# EAGLE schematic VERSAO-01 (EAGLE 5.06)
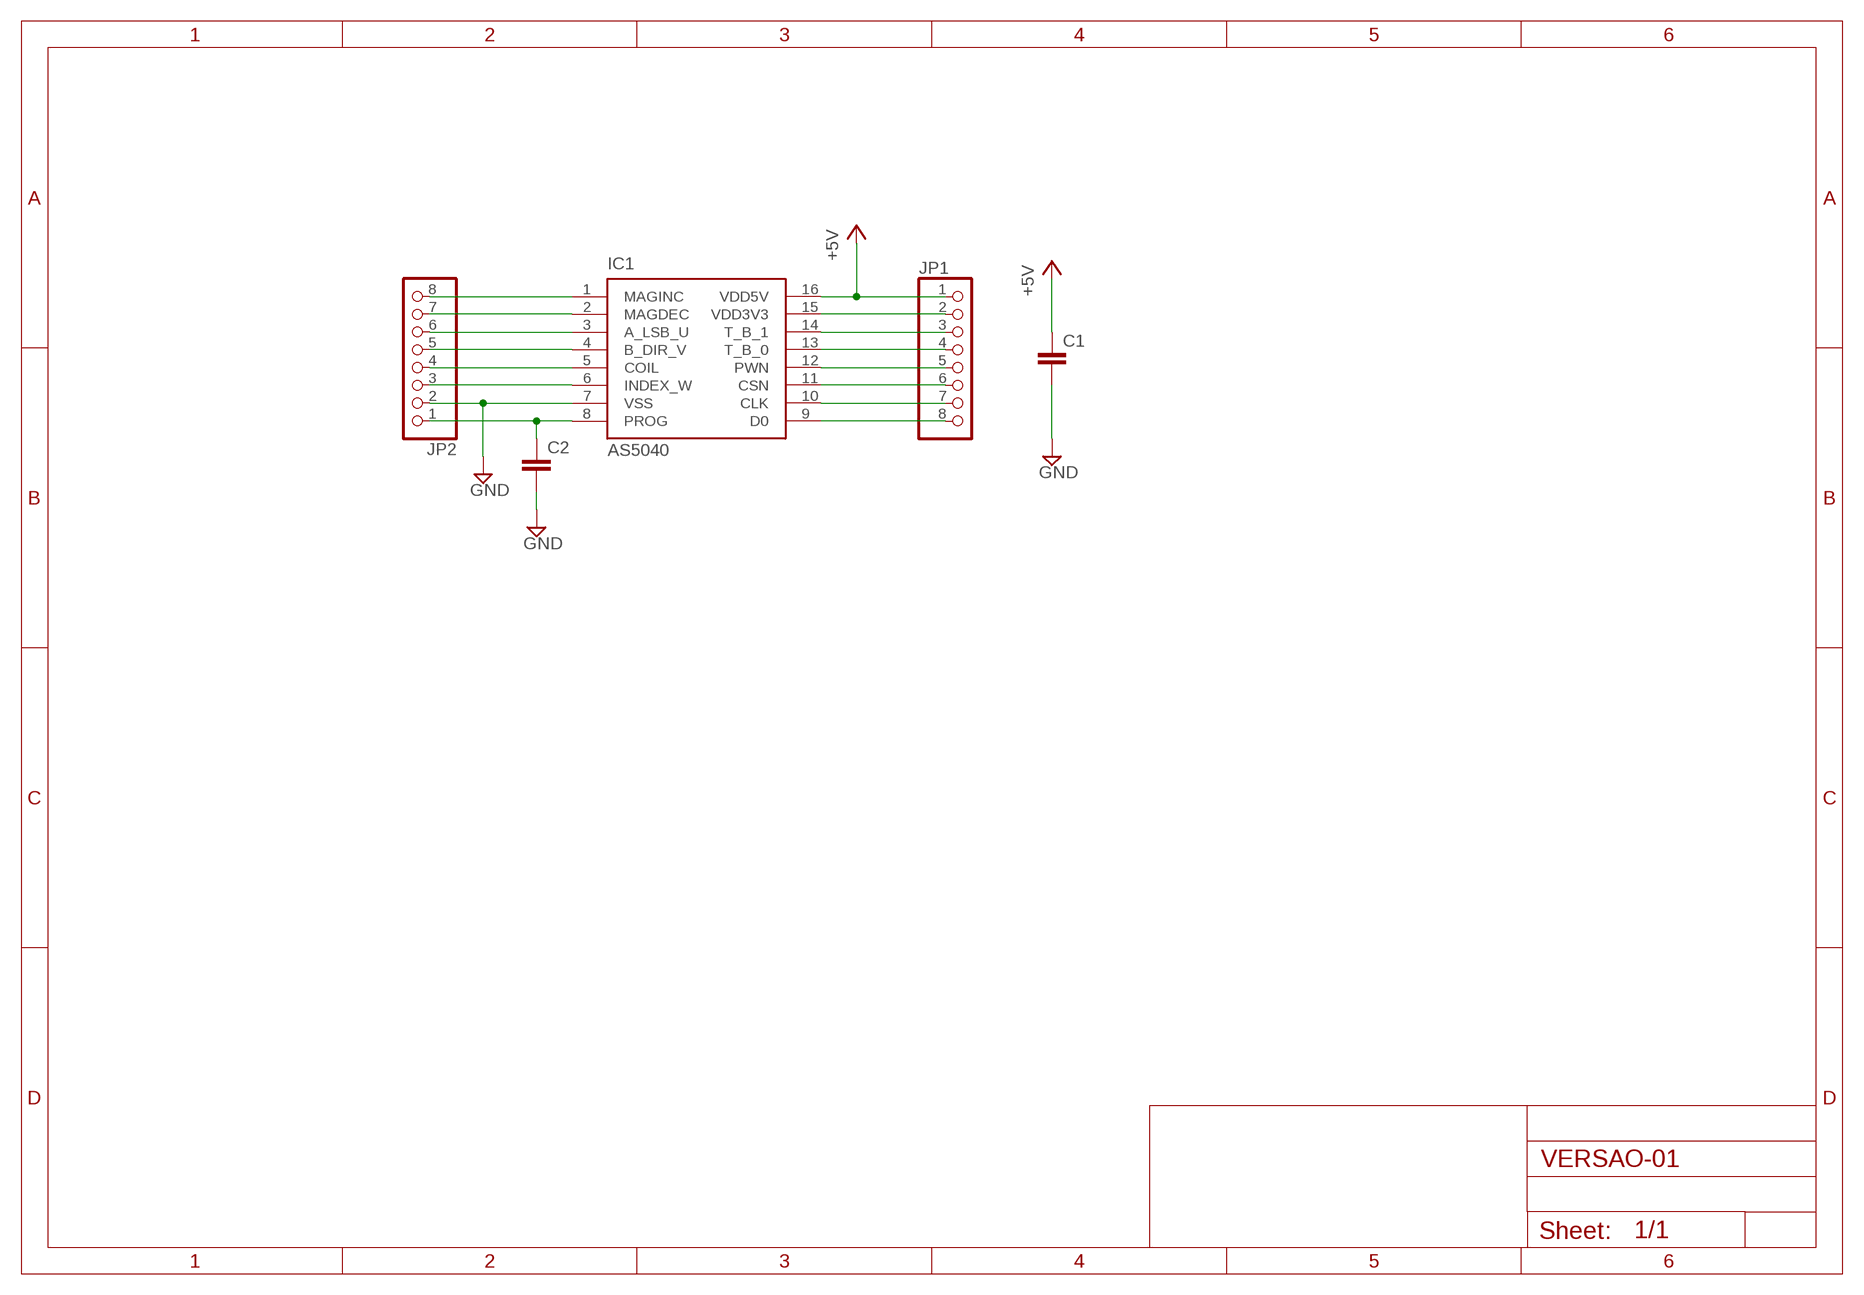
[diagram p0: schematic, sheet 1]

## Parts
C1  C-EU050-025X075  [C050-025X075]
C2  C-EU050-025X075  [C050-025X075]
IC1  AS5040  [SSOP16]
JP1  PINHD-1X8  [1X08]
JP2  PINHD-1X8  [1X08]

## Nets
+5V: C1.1 IC1.16(VDD5V) JP1.1
GND: C1.2 C2.2 IC1.7(VSS) JP2.2
N$1: IC1.1(MAGINC) JP2.8
N$2: IC1.2(MAGDEC) JP2.7
N$3: IC1.3(A_LSB_U) JP2.6
N$4: IC1.4(B_DIR_V) JP2.5
N$5: IC1.5(COIL) JP2.4
N$6: IC1.6(INDEX_W) JP2.3
N$8: C2.1 IC1.8(PROG) JP2.1
N$10: IC1.15(VDD3V3) JP1.2
N$11: IC1.14(T_B_1) JP1.3
N$12: IC1.13(T_B_0) JP1.4
N$13: IC1.12(PWN) JP1.5
N$14: IC1.11(CSN) JP1.6
N$15: IC1.10(CLK) JP1.7
N$17: IC1.9(D0) JP1.8

## Library data of the parts
C1 C2 = rcl:C-EU: CAPACITOR, European symbol
IC1 = austriamicrosystems:AS5040: 10-BIT PROGRAMMABLE MAGNETIC ROTARY ENCODER Source: www.austriamicrosystems.com .. AS5040DataSheetRev12.pdf
JP1 JP2 = pinhead:PINHD-1X8: PIN HEADER

## Net classes
0 default: width 0.508 mm, drill 0.508 mm, clearance 0.508 mm
1 2: width 1.016 mm, drill 0.508 mm, clearance 0.762 mm
2 3: width 1.016 mm, drill 1.016 mm, clearance 1.524 mm